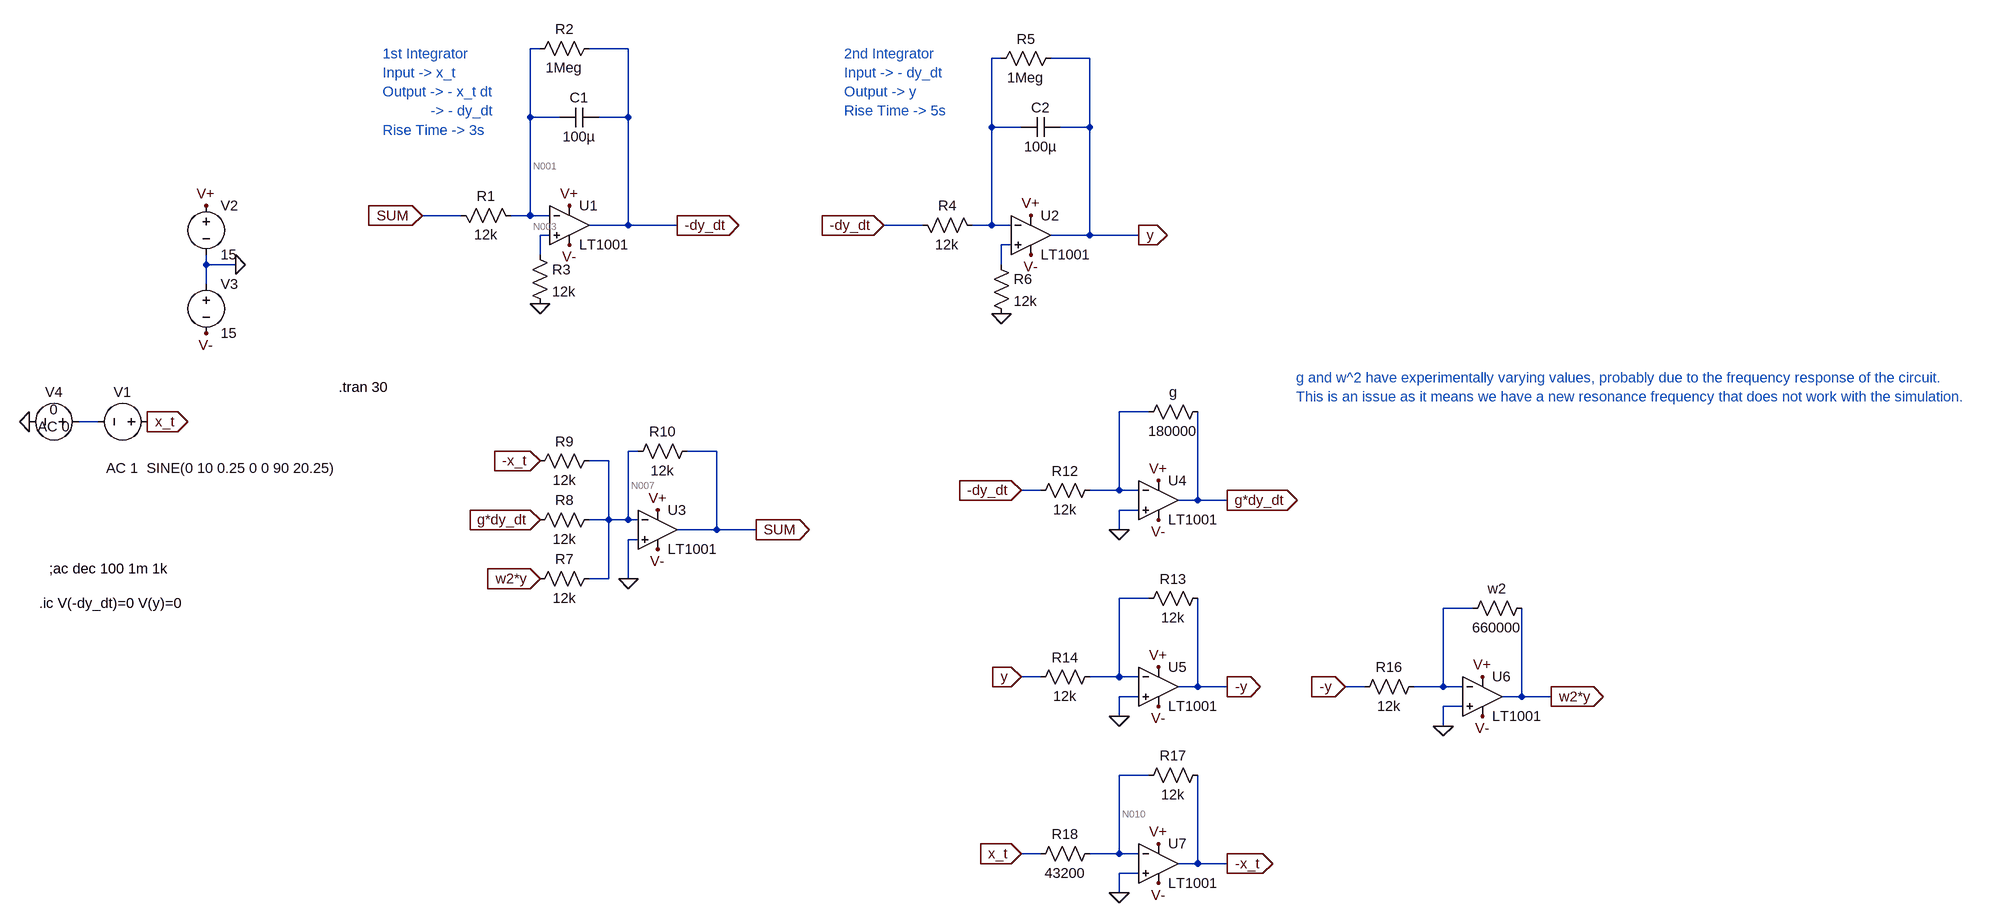
[diagram p0: schematic Analogue_Computer_2.asc]
Analogue_Computer_2.asc, the LTspice schematic file:
Version 4
SHEET 1 2476 1080
WIRE 32 -352 16 -352
WIRE 176 -352 112 -352
WIRE 784 -336 768 -336
WIRE 928 -336 864 -336
WIRE 16 -240 16 -352
WIRE 64 -240 16 -240
WIRE 176 -240 176 -352
WIRE 176 -240 128 -240
WIRE 768 -224 768 -336
WIRE 816 -224 768 -224
WIRE 928 -224 928 -336
WIRE 928 -224 880 -224
WIRE -96 -80 -160 -80
WIRE 16 -80 16 -240
WIRE 16 -80 -16 -80
WIRE 48 -80 16 -80
WIRE 176 -64 176 -240
WIRE 176 -64 112 -64
WIRE 256 -64 176 -64
WIRE 656 -64 592 -64
WIRE 768 -64 768 -224
WIRE 768 -64 736 -64
WIRE 800 -64 768 -64
WIRE 48 -48 32 -48
WIRE 928 -48 928 -224
WIRE 928 -48 864 -48
WIRE 1008 -48 928 -48
WIRE 800 -32 784 -32
WIRE 32 -16 32 -48
WIRE -512 0 -512 -16
WIRE -464 0 -512 0
WIRE 784 0 784 -32
WIRE -512 32 -512 0
WIRE 1024 240 976 240
WIRE -688 256 -720 256
WIRE 192 304 176 304
WIRE 320 304 272 304
WIRE 144 320 112 320
WIRE 848 368 816 368
WIRE 976 368 976 240
WIRE 976 368 928 368
WIRE 1008 368 976 368
WIRE 1104 384 1104 240
WIRE 1104 384 1072 384
WIRE 1152 384 1104 384
WIRE 1008 400 976 400
WIRE 144 416 144 320
WIRE 144 416 112 416
WIRE 176 416 176 304
WIRE 176 416 144 416
WIRE 192 416 176 416
WIRE 320 432 320 304
WIRE 320 432 256 432
WIRE 384 432 320 432
WIRE 976 432 976 400
WIRE 192 448 176 448
WIRE 144 512 144 416
WIRE 144 512 112 512
WIRE 176 512 176 448
WIRE 1024 544 976 544
WIRE 1552 560 1504 560
WIRE 848 672 816 672
WIRE 976 672 976 544
WIRE 976 672 928 672
WIRE 1008 672 976 672
WIRE 1104 688 1104 544
WIRE 1104 688 1072 688
WIRE 1152 688 1104 688
WIRE 1376 688 1344 688
WIRE 1504 688 1504 560
WIRE 1504 688 1456 688
WIRE 1536 688 1504 688
WIRE 1008 704 976 704
WIRE 1632 704 1632 560
WIRE 1632 704 1600 704
WIRE 1680 704 1632 704
WIRE 1536 720 1504 720
WIRE 976 736 976 704
WIRE 1504 752 1504 720
WIRE 1024 832 976 832
WIRE 848 960 816 960
WIRE 976 960 976 832
WIRE 976 960 928 960
WIRE 1008 960 976 960
WIRE 1104 976 1104 832
WIRE 1104 976 1072 976
WIRE 1152 976 1104 976
WIRE 1008 992 976 992
WIRE 976 1024 976 992
FLAG -464 0 0
FLAG -512 -96 V+
FLAG -512 112 V-
FLAG 80 -96 V+
FLAG 80 -32 V-
FLAG 256 -64 -dy_dt
IOPIN 256 -64 Out
FLAG 32 64 0
FLAG -608 256 x_t
IOPIN -608 256 Out
FLAG 832 -80 V+
FLAG 832 -16 V-
FLAG 1008 -48 y
IOPIN 1008 -48 Out
FLAG 784 80 0
FLAG 592 -64 -dy_dt
IOPIN 592 -64 In
FLAG 224 400 V+
FLAG 224 464 V-
FLAG 384 432 SUM
IOPIN 384 432 Out
FLAG 176 512 0
FLAG -160 -80 SUM
IOPIN -160 -80 In
FLAG 976 432 0
FLAG 816 368 -dy_dt
IOPIN 816 368 In
FLAG 1152 384 g*dy_dt
IOPIN 1152 384 Out
FLAG 976 736 0
FLAG 816 672 y
IOPIN 816 672 In
FLAG 1152 688 -y
IOPIN 1152 688 Out
FLAG 1504 752 0
FLAG 1344 688 -y
IOPIN 1344 688 In
FLAG 1680 704 w2*y
IOPIN 1680 704 Out
FLAG 976 1024 0
FLAG 816 960 x_t
IOPIN 816 960 In
FLAG 1152 976 -x_t
IOPIN 1152 976 Out
FLAG 32 320 -x_t
IOPIN 32 320 In
FLAG 32 512 w2*y
IOPIN 32 512 In
FLAG 32 416 g*dy_dt
IOPIN 32 416 In
FLAG 1040 944 V+
FLAG 1040 656 V+
FLAG 1568 672 V+
FLAG 1040 352 V+
FLAG 1040 1008 V-
FLAG 1568 736 V-
FLAG 1040 720 V-
FLAG 1040 416 V-
FLAG -800 256 0
SYMBOL OpAmps\\LT1001 80 -128 R0
SYMATTR InstName U1
SYMBOL res -112 -96 M90
WINDOW 0 0 56 VBottom 2
WINDOW 3 32 56 VTop 2
SYMATTR InstName R1
SYMATTR Value 12k
SYMBOL voltage -592 256 R90
WINDOW 0 -32 56 VBottom 2
WINDOW 3 60 -141 VTop 2
WINDOW 123 60 56 VTop 2
WINDOW 39 0 0 Left 0
SYMATTR InstName V1
SYMATTR Value SINE(0 10 0.25 0 0 90 20.25)
SYMATTR Value2 AC 1
SYMBOL voltage -512 -112 R0
WINDOW 123 0 0 Left 0
WINDOW 39 0 0 Left 0
SYMATTR InstName V2
SYMATTR Value 15
SYMBOL voltage -512 16 R0
WINDOW 123 0 0 Left 0
WINDOW 39 0 0 Left 0
SYMATTR InstName V3
SYMATTR Value 15
SYMBOL cap 128 -256 R90
WINDOW 0 0 32 VBottom 2
WINDOW 3 32 32 VTop 2
SYMATTR InstName C1
SYMATTR Value 100µ
SYMBOL res 128 -368 R90
WINDOW 0 0 56 VBottom 2
WINDOW 3 32 56 VTop 2
SYMATTR InstName R2
SYMATTR Value 1Meg
SYMBOL res 16 -32 R0
SYMATTR InstName R3
SYMATTR Value 12k
SYMBOL OpAmps\\LT1001 832 -112 R0
SYMATTR InstName U2
SYMBOL res 640 -80 M90
WINDOW 0 0 56 VBottom 2
WINDOW 3 32 56 VTop 2
SYMATTR InstName R4
SYMATTR Value 12k
SYMBOL cap 880 -240 R90
WINDOW 0 0 32 VBottom 2
WINDOW 3 32 32 VTop 2
SYMATTR InstName C2
SYMATTR Value 100µ
SYMBOL res 880 -352 R90
WINDOW 0 0 56 VBottom 2
WINDOW 3 32 56 VTop 2
SYMATTR InstName R5
SYMATTR Value 1Meg
SYMBOL res 768 -16 R0
SYMATTR InstName R6
SYMATTR Value 12k
SYMBOL OpAmps\\LT1001 224 368 R0
SYMATTR InstName U3
SYMBOL res 128 496 R90
WINDOW 0 0 56 VBottom 2
WINDOW 3 32 56 VTop 2
SYMATTR InstName R7
SYMATTR Value 12k
SYMBOL res 128 400 R90
WINDOW 0 0 56 VBottom 2
WINDOW 3 32 56 VTop 2
SYMATTR InstName R8
SYMATTR Value 12k
SYMBOL res 128 304 R90
WINDOW 0 0 56 VBottom 2
WINDOW 3 32 56 VTop 2
SYMATTR InstName R9
SYMATTR Value 12k
SYMBOL res 288 288 R90
WINDOW 0 0 56 VBottom 2
WINDOW 3 32 56 VTop 2
SYMATTR InstName R10
SYMATTR Value 12k
SYMBOL OpAmps\\LT1001 1040 320 R0
SYMATTR InstName U4
SYMBOL res 1120 224 R90
WINDOW 0 0 56 VBottom 2
WINDOW 3 32 56 VTop 2
SYMATTR InstName g
SYMATTR Value 180000
SYMBOL res 944 352 R90
WINDOW 0 0 56 VBottom 2
WINDOW 3 32 56 VTop 2
SYMATTR InstName R12
SYMATTR Value 12k
SYMBOL OpAmps\\LT1001 1040 624 R0
SYMATTR InstName U5
SYMBOL res 1120 528 R90
WINDOW 0 0 56 VBottom 2
WINDOW 3 32 56 VTop 2
SYMATTR InstName R13
SYMATTR Value 12k
SYMBOL res 944 656 R90
WINDOW 0 0 56 VBottom 2
WINDOW 3 32 56 VTop 2
SYMATTR InstName R14
SYMATTR Value 12k
SYMBOL OpAmps\\LT1001 1568 640 R0
SYMATTR InstName U6
SYMBOL res 1648 544 R90
WINDOW 0 0 56 VBottom 2
WINDOW 3 32 56 VTop 2
SYMATTR InstName w2
SYMATTR Value 660000
SYMBOL res 1472 672 R90
WINDOW 0 0 56 VBottom 2
WINDOW 3 32 56 VTop 2
SYMATTR InstName R16
SYMATTR Value 12k
SYMBOL OpAmps\\LT1001 1040 912 R0
SYMATTR InstName U7
SYMBOL res 1120 816 R90
WINDOW 0 0 56 VBottom 2
WINDOW 3 32 56 VTop 2
SYMATTR InstName R17
SYMATTR Value 12k
SYMBOL res 944 944 R90
WINDOW 0 0 56 VBottom 2
WINDOW 3 32 56 VTop 2
SYMATTR InstName R18
SYMATTR Value 43200
SYMBOL voltage -704 256 R90
WINDOW 0 -32 56 VBottom 2
WINDOW 3 -4 56 VBottom 2
WINDOW 123 24 56 VBottom 2
WINDOW 39 0 0 Left 0
SYMATTR InstName V4
SYMATTR Value 0
SYMATTR Value2 AC 0
TEXT -768 496 Left 2 !;ac dec 100 1m 1k
TEXT -784 552 Left 2 !.ic V(-dy_dt)=0 V(y)=0
TEXT -224 -344 Left 2 ;1st Integrator\nInput -> x_t\nOutput -> - x_t dt\n            -> - dy_dt\nRise Time -> 3s
TEXT 528 -344 Left 2 ;2nd Integrator\nInput -> - dy_dt\nOutput -> y\nRise Time -> 5s
TEXT -296 200 Left 2 !.tran 30
TEXT 1264 184 Left 2 ;g and w^2 have experimentally varying values, probably due to the frequency response of the circuit.\nThis is an issue as it means we have a new resonance frequency that does not work with the simulation.

The netlist it stands for:
* Analogue_Computer_2.asc
XU1 N003 N001 V+ V- -dy_dt LT1001  ; pins In+ In- V+ V- OUT
R1 SUM N001 12k
V1 x_t N006 SINE(0 10 0.25 0 0 90 20.25) AC 1
V2 V+ 0 15
V3 0 V- 15
C1 -dy_dt N001 100µ
R2 -dy_dt N001 1Meg
R3 N003 0 12k
XU2 N004 N002 V+ V- y LT1001  ; pins In+ In- V+ V- OUT
R4 -dy_dt N002 12k
C2 y N002 100µ
R5 y N002 1Meg
R6 N004 0 12k
XU3 0 N007 V+ V- SUM LT1001  ; pins In+ In- V+ V- OUT
R7 N007 w2*y 12k
R8 N007 g*dy_dt 12k
R9 N007 -x_t 12k
R10 SUM N007 12k
XU4 0 N005 V+ V- g*dy_dt LT1001  ; pins In+ In- V+ V- OUT
R§g g*dy_dt N005 180000
R12 N005 -dy_dt 12k
XU5 0 N008 V+ V- -y LT1001  ; pins In+ In- V+ V- OUT
R13 -y N008 12k
R14 N008 y 12k
XU6 0 N009 V+ V- w2*y LT1001  ; pins In+ In- V+ V- OUT
R§w2 w2*y N009 660000
R16 N009 -y 12k
XU7 0 N010 V+ V- -x_t LT1001  ; pins In+ In- V+ V- OUT
R17 -x_t N010 12k
R18 N010 x_t 43200
V4 N006 0 0 AC 0
;ac dec 100 1m 1k
.ic V(-dy_dt)=0 V(y)=0
* 1st Integrator
* Input -> x_t
* Output -> - x_t dt
*             -> - dy_dt
* Rise Time -> 3s
* 2nd Integrator
* Input -> - dy_dt
* Output -> y
* Rise Time -> 5s
.tran 30
* g and w^2 have experimentally varying values, probably due to the frequency response of the circuit.
* This is an issue as it means we have a new resonance frequency that does not work with the simulation.
.lib LTC.lib
.backanno
.end

* Results of the author's LTspice run, read from the files saved beside the schematic
* Operating Point, zero values left out:
*   V(n001) = 2.059 V
*   V(n003) = 694.2 mV
*   V(v+) = 15 V
*   V(v-) = -15 V
*   V(sum) = 2.778 V
*   V(x_t) = 10 V
*   V(n007) = -3.735 µV
*   V(-x_t) = -2.778 V
*   V(n010) = 3.743 µV
*   I(R18) = -231.5 µA
*   I(R17) = -231.5 µA
*   I(R10) = 231.5 µA
*   I(R9) = 231.5 µA
*   I(R8) = -311.2 pA
*   I(R7) = -311.2 pA
*   I(R3) = 57.85 µA
*   I(R2) = -2.059 µA
*   I(R1) = 59.91 µA
*   I(V4) = -231.5 µA
*   I(V3) = -52.03 mA
*   I(V2) = -13.42 mA
*   I(V1) = -231.5 µA
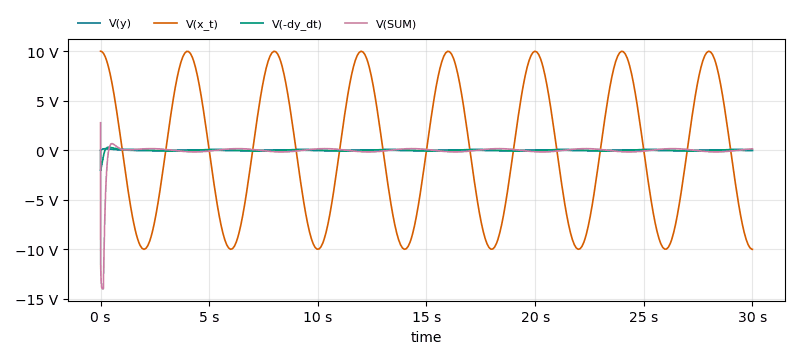
[diagram p1: Transient Analysis of Analogue_Computer_2.asc, plotted from the saved traces]
* Transient Analysis, 1 run:
*   V(y): min -47.15 mV, max 158.8 mV, average 2.627 mV, rms 37.25 mV, last -41.36 mV
*   V(x_t): min -10 V, max 10 V, average 168.9 µV, rms 7.071 V, last -10 V
*   V(-dy_dt): min -2.07 V, max 311.4 mV, average 1.569 mV, rms 117.9 mV, last 43.28 mV
*   V(SUM): min -13.99 V, max 2.778 V, average -84.56 mV, rms 1.052 V, last 146 mV